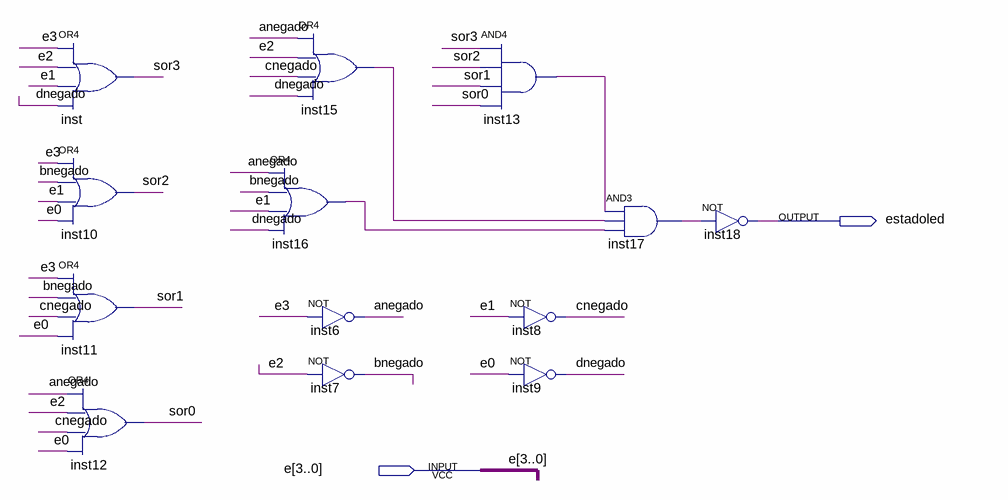
[diagram p0: schematic sheet]
// Quartus schematic visor0.bdf as structural Verilog: 13 symbols, 2 pins
module visor0 (
  input  [3:0] e,
  output estadoled
);

  wire anegado, bnegado, cnegado, dnegado, inst13_out, inst15_out, inst16_out, inst17_out, sor0, sor1, sor2,
       sor3;

  or inst (sor3, e[3], e[2], e[1], dnegado);
  or inst10 (sor2, e[3], bnegado, e[1], e[0]);
  or inst11 (sor1, e[3], bnegado, cnegado, e[0]);
  or inst12 (sor0, anegado, e[2], cnegado, e[0]);
  or inst16 (inst16_out, anegado, bnegado, e[1], dnegado);
  or inst15 (inst15_out, anegado, e[2], cnegado, dnegado);
  not inst6 (anegado, e[3]);
  not inst7 (bnegado, e[2]);
  and inst13 (inst13_out, sor3, sor2, sor1, sor0);
  not inst8 (cnegado, e[1]);
  not inst9 (dnegado, e[0]);
  and inst17 (inst17_out, inst13_out, inst15_out, inst16_out);
  not inst18 (estadoled, inst17_out);
endmodule
